# EAGLE schematic Version1 (EAGLE 9.6.2)
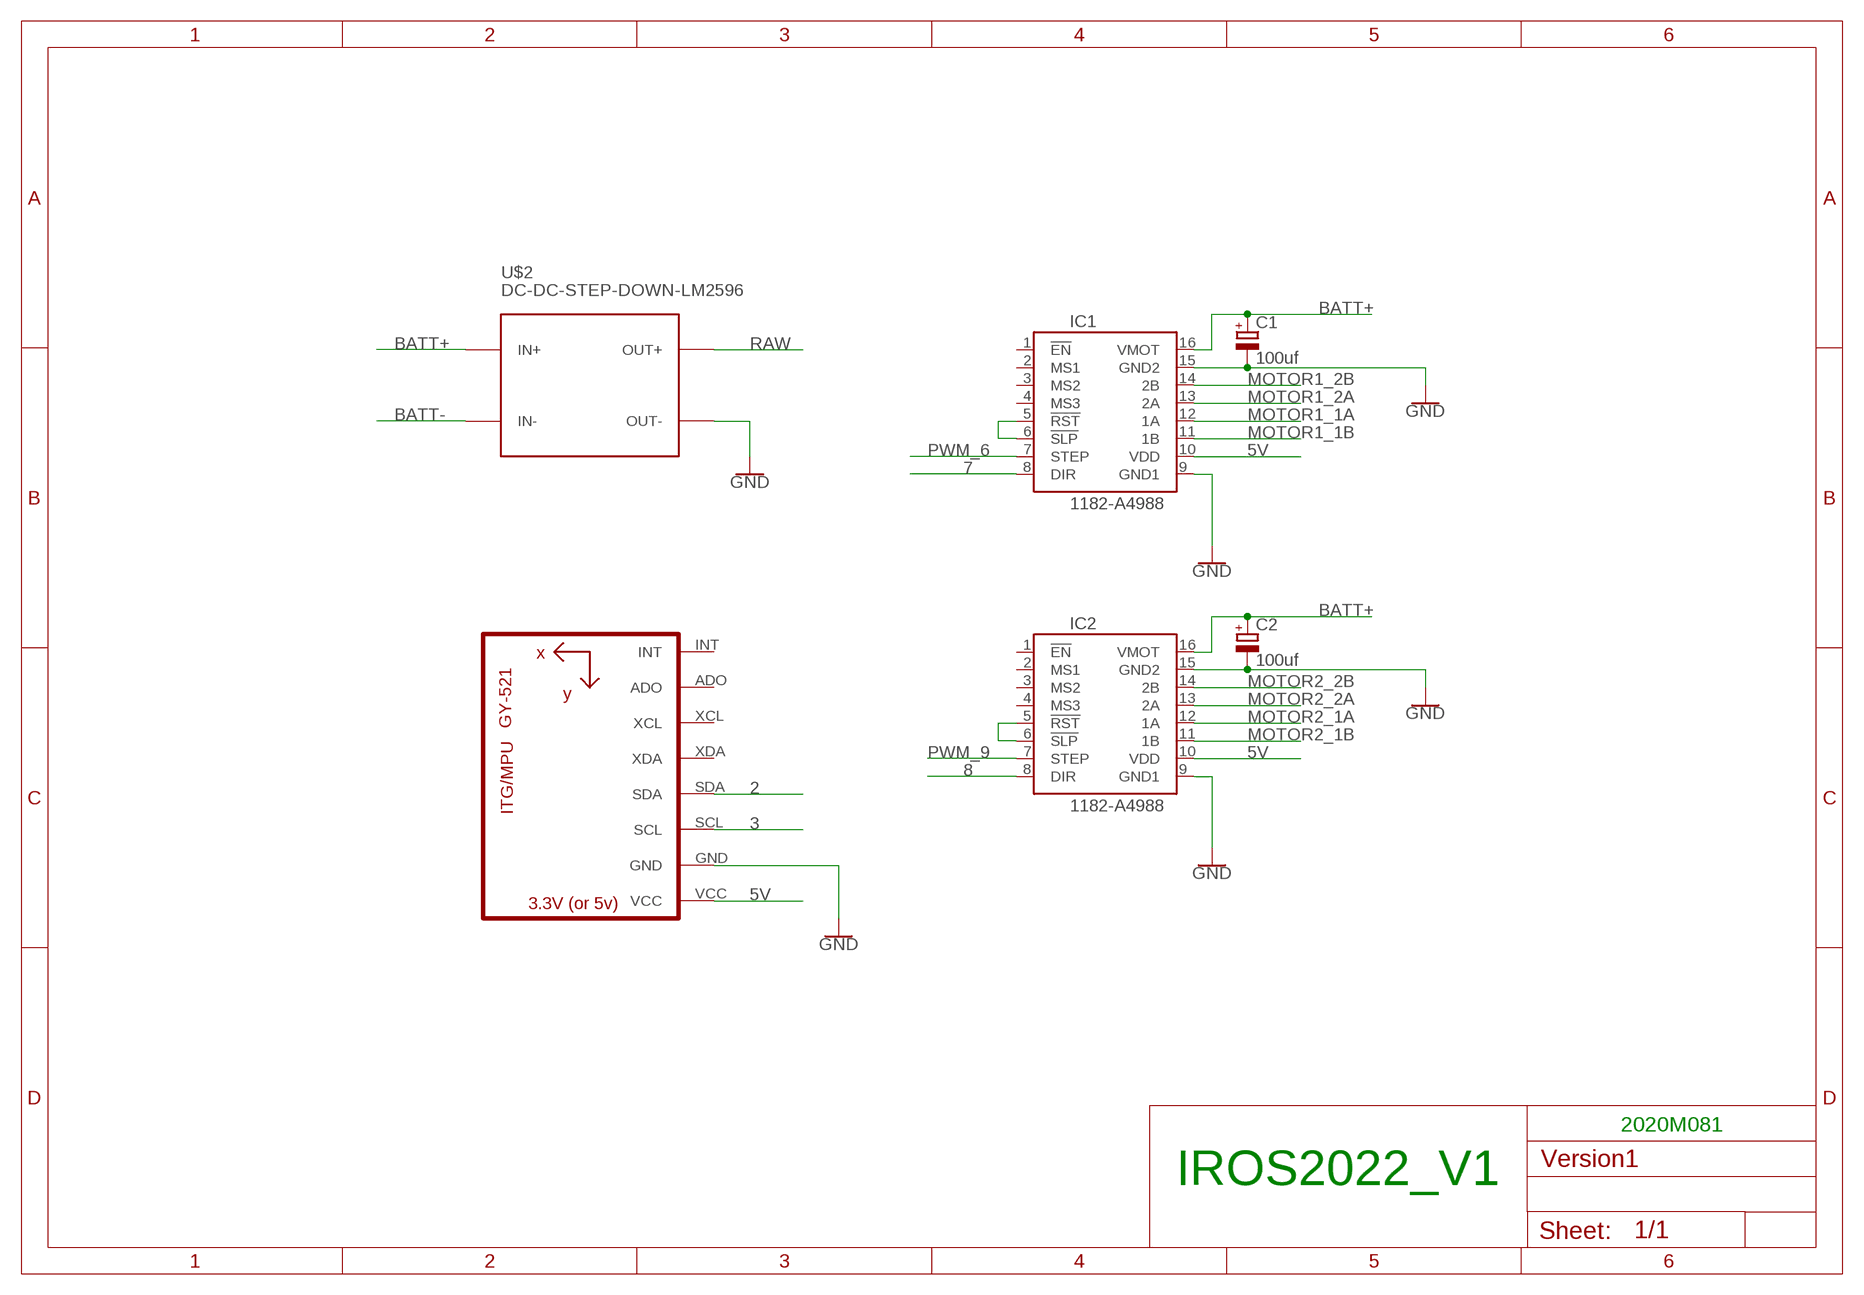
[diagram p0: schematic, sheet 1]

## Parts
C1  100uf  CPOL-EUE5-10.5  [E5-10,5]
C2  100uf  CPOL-EUE5-10.5  [E5-10,5]
IC1  1182-A4988  [A4988]
IC2  1182-A4988  [A4988]
U1  GY-521MPU6050  [GY-521]
U$2  DC-DC-STEP-DOWN-LM2596  [DC-DC-STEP-DOWN-LM2596]

## Nets
2: U1.SDA
3: U1.SCL
5V: IC1.10(VDD) IC2.10(VDD) U1.VCC
7: IC1.8(DIR)
8: IC2.8(DIR)
BATT+: C1.+ C2.+ IC1.16(VMOT) IC2.16(VMOT) U$2.IN+
BATT-: U$2.IN-
GND: C1.- C2.- IC1.9(GND1) IC1.15(GND2) IC2.9(GND1) IC2.15(GND2) U1.GND U$2.OUT-
MOTOR1_1A: IC1.12(1A)
MOTOR1_1B: IC1.11(1B)
MOTOR1_2A: IC1.13(2A)
MOTOR1_2B: IC1.14(2B)
MOTOR2_1A: IC2.12(1A)
MOTOR2_1B: IC2.11(1B)
MOTOR2_2A: IC2.13(2A)
MOTOR2_2B: IC2.14(2B)
N$17: IC1.5(!RST) IC1.6(!SLP)
N$18: IC2.5(!RST) IC2.6(!SLP)
PWM_6: IC1.7(STEP)
PWM_9: IC2.7(STEP)
RAW: U$2.OUT+
Unconnected: IC1.1(!EN) IC1.2(MS1) IC1.3(MS2) IC1.4(MS3) IC2.1(!EN) IC2.2(MS1) IC2.3(MS2) IC2.4(MS3) U1.ADO U1.INT U1.XCL U1.XDA

## Notes on the sheet
- 2020M081
- IROS2022_V1

## Library data of the parts
C1 C2 = rcl:CPOL-EU: POLARIZED CAPACITOR, European symbol; SPICEPREFIX: C
IC1 IC2 = pololu-stepper-driver:1182-A4988: A4988 Stepper Motor Driver Carrier #1182 A4988 Stepper Motor Driver Carrier <https://www.pololu.com/product/1182> in Japan, Suzaku Lab. Ltd. <https://suzakugiken.jp/> #1182 A4988ステッピングモータドライバ <https://szc.jp/po1182>
U1 = gy-521:GY-521
U$2 = diy-modules:DC-DC-STEP-DOWN-LM2596: DC/DC Step-Down Regulator based on LM2596-ADJ chip